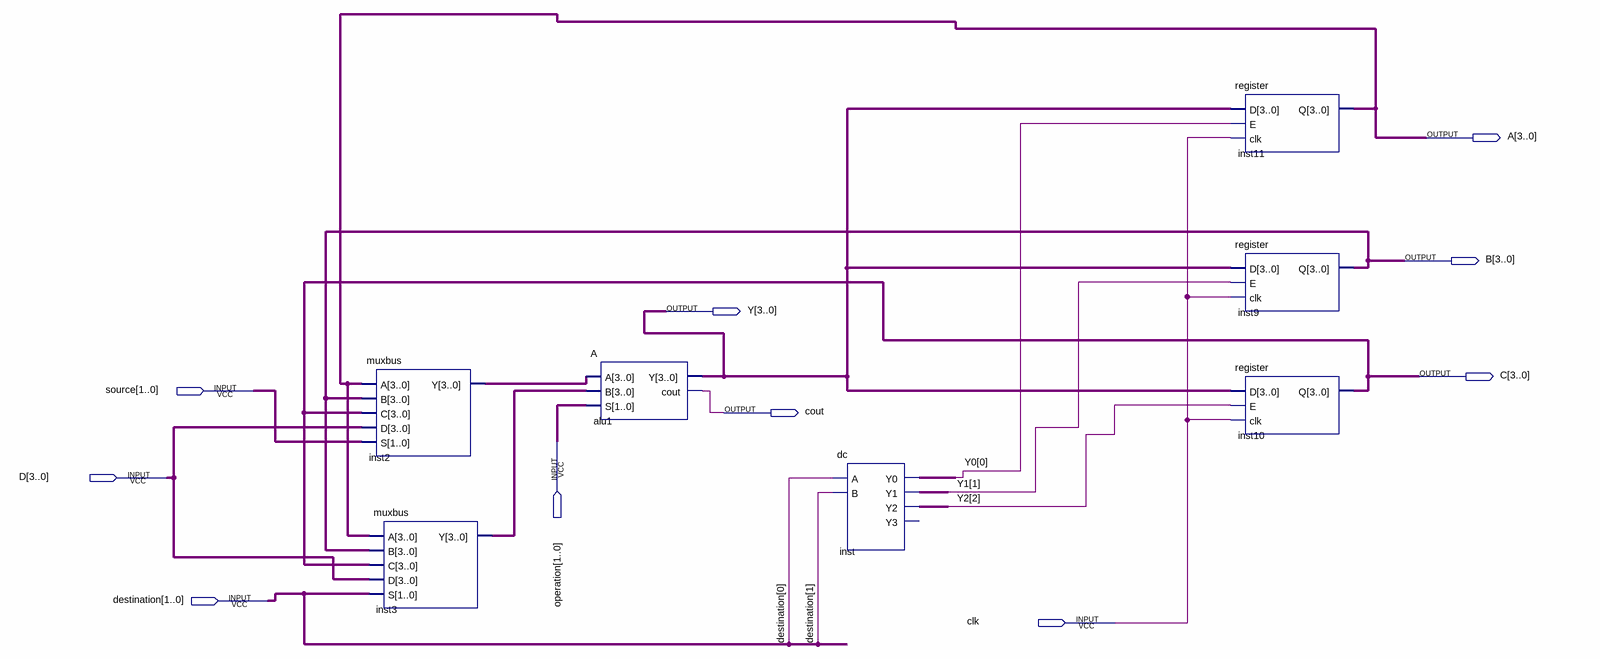
[diagram p0: schematic sheet]
// Quartus schematic Eu.bdf as structural Verilog: 7 symbols, 10 pins
module Eu (
  input  [1:0] source,
  input  [1:0] operation,
  input  [3:0] D,
  input  [1:0] destination,
  input  clk,
  output [3:0] A,
  output [3:0] B,
  output [3:0] Y,
  output [3:0] C,
  output cout
);

  wire inst_y0, inst_y1, inst_y2;
  wire [0:0] Y0;
  wire [1:1] Y1;
  wire [2:2] Y2;
  wire [3:0] inst2_y, inst3_y;

  muxbus inst2 (.A(A), .B(B), .C(C), .D(D), .S(source), .Y(inst2_y));
  muxbus inst3 (.A(A), .B(B), .C(C), .D(D), .S(destination), .Y(inst3_y));
  A alu1 (.A(inst2_y), .B(inst3_y), .S(operation), .Y(Y), .cout(cout));
  dc inst (.A(destination[0]), .B(destination[1]), .Y0(inst_y0), .Y1(inst_y1), .Y2(inst_y2));  // open: Y3
  register inst11 (.D(Y), .E(Y0[0]), .clk(clk), .Q(A));
  register inst9 (.D(Y), .E(Y1[1]), .clk(clk), .Q(B));
  register inst10 (.D(Y), .E(Y2[2]), .clk(clk), .Q(C));
endmodule
